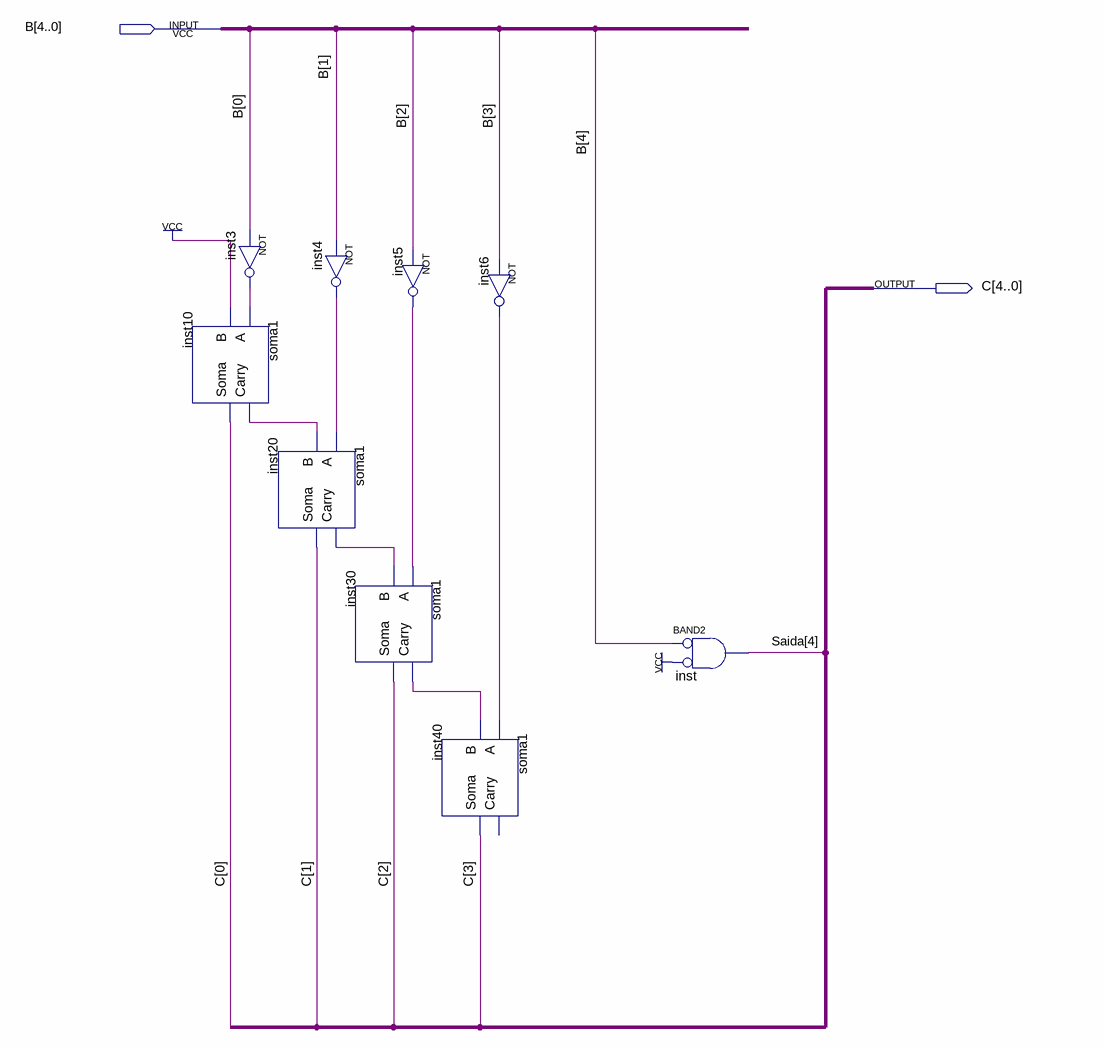
[diagram p0: schematic sheet]
// Quartus schematic Comp_soma.bdf as structural Verilog: 9 symbols, 2 pins
module Comp_soma (
  input  [4:0] B,
  output [4:0] C
);

  wire inst3_out, inst4_out, inst5_out, inst6_out, inst10_carry, inst20_carry, inst30_carry;
  wire [4:4] Saida;

  soma1 inst10 (.A(inst3_out), .B(1'b1), .Carry(inst10_carry), .Soma(C[0]));
  not inst3 (inst3_out, B[0]);
  soma1 inst20 (.A(inst4_out), .B(inst10_carry), .Carry(inst20_carry), .Soma(C[1]));
  not inst4 (inst4_out, B[1]);
  soma1 inst30 (.A(inst5_out), .B(inst20_carry), .Carry(inst30_carry), .Soma(C[2]));
  not inst5 (inst5_out, B[2]);
  soma1 inst40 (.A(inst6_out), .B(inst30_carry), .Soma(C[3]));  // open: Carry
  not inst6 (inst6_out, B[3]);
  and inst (Saida[4], ~B[4], ~1'b1);  // BAND2
endmodule
